# Altium schematic sheet Power1.SchDoc (part 1 of 2)
size A; SheetNumber: 1; SheetTotal: 6
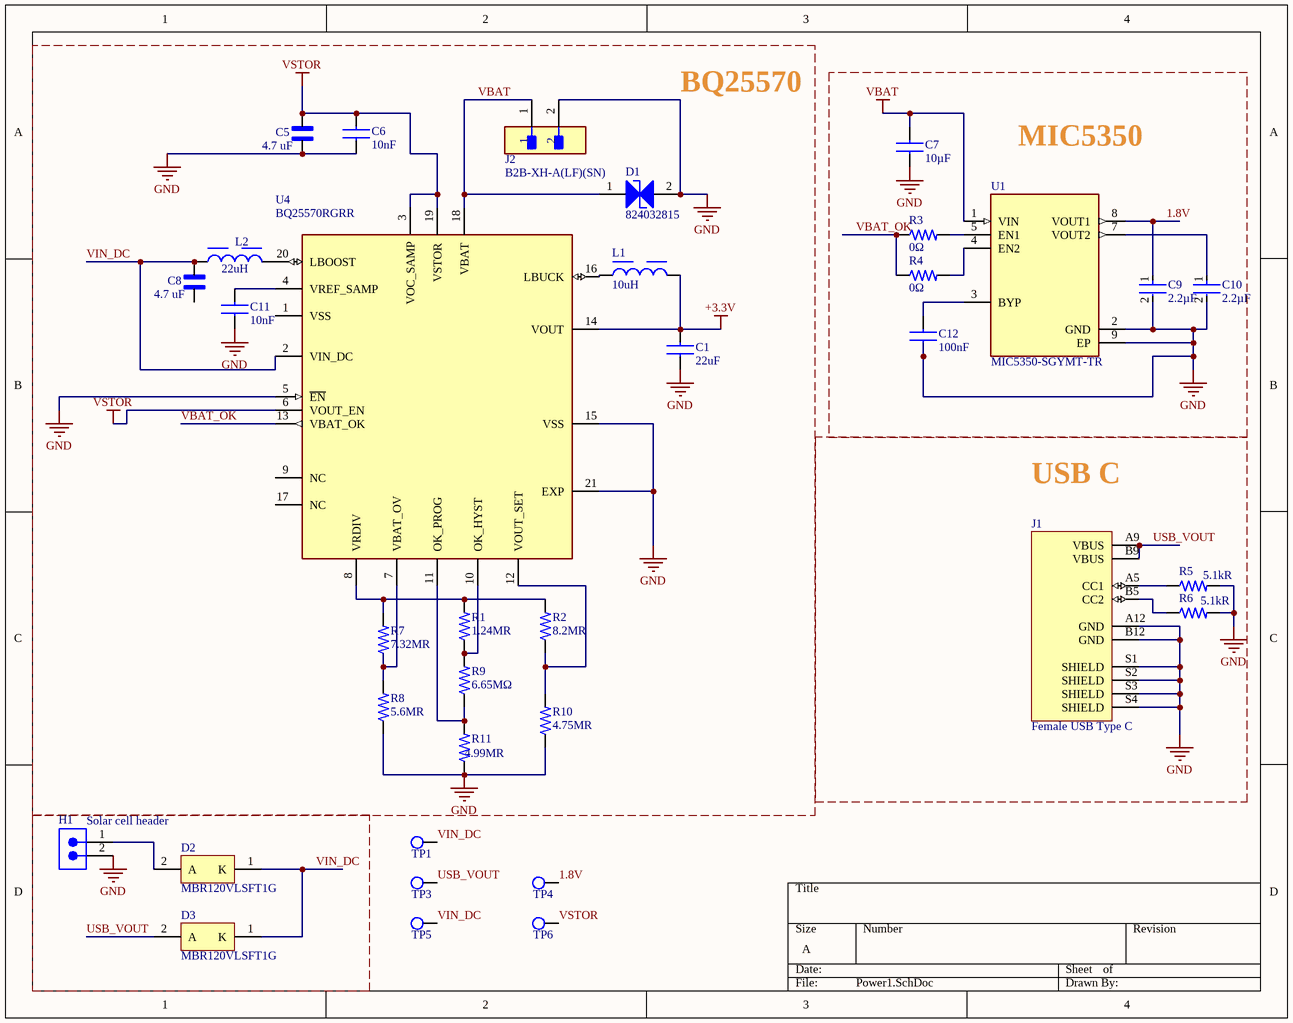
[diagram p0: Power1.SchDoc]

## Parts
C1  22uF  [CAP_0603_1MM]
C5  4.7 uF  [CAPC1608X90N]
C6  value 10nF  [CAP_0603_1MM]  (hidden comment: CAP 10nF 0603)
C7  value 10µF  [CAP_0603_1MM]  (hidden comment: CAP 10uF 0603)
C8  4.7 uF  [CAPC1608X90N]
C9  value 2.2µF  [CAP_0603_1MM]  (hidden comment: CAP 2.2uF 0603)
C10  value 2.2µF  [CAP_0603_1MM]  (hidden comment: CAP 2.2uF 0603)
C11  value 10nF  [CAP_0603_1MM]  (hidden comment: CAP 10nF 0603)
C12  value 100nF  [CAP_0603_1MM]  (hidden comment: CAP 0.1uF 0603)
D1  824032815  [WE-TVS_DFN1610-2L]
D2  MBR120VLSFT1G  [ONSC-SOD-123FL-2-498-01_V]
D3  MBR120VLSFT1G  [ONSC-SOD-123FL-2-498-01_V]
H1  Solar cell header  [2-PIN_MALE_HEADER_01-IN]
J1  Female USB Type C  [GCT_USB4125-GF-A_REVA2]
J2  B2B-XH-A(LF)(SN)  [FP-B2B-XH-A_LF_SN-MFG]
L1  10uH  [WE-TPC_2813]
L2  22uH  [WE-TPC_3816]
R1  value 1.24MR  [RES_0603_1608X06]  (hidden comment: RES 1.24M 0603)
R2  value 8.2MR  [RES_0603_1608X06]  (hidden comment: RES 8.2M 0603)
R3  value 0Ω  [RES_0603_1608X06]  (hidden comment: RES 0R 0603)
R4  value 0Ω  [RES_0603_1608X06]  (hidden comment: RES 0R 0603)
R5  value 5.1kR  [RES_0603_1608X06]  (hidden comment: RES 5.1K 0603)
R6  value 5.1kR  [RES_0603_1608X06]  (hidden comment: RES 5.1K 0603)
R7  value 7.32MR  [RES_0603_1608X06]  (hidden comment: RES 7.32M 0603)
R8  value 5.6MR  [RES_0603_1608X06]  (hidden comment: RES 5.62M 0603)
R9  value 6.65MΩ  [RES_0603_1608X06]  (hidden comment: RES 6.65M 0603)
R10  value 4.75MR  [RES_0603_1608X06]  (hidden comment: RES 4.75M 0603)
R11  value 4.99MR  [RES_0603_1608X06]  (hidden comment: RES 4.99M 0603)
TP1  Test Point  [Test Point]  (value not drawn)  (net tie, no BOM)
TP3  Test Point  [Test Point]  (value not drawn)  (net tie, no BOM)
TP4  Test Point  [Test Point]  (value not drawn)  (net tie, no BOM)
TP5  Test Point  [Test Point]  (value not drawn)  (net tie, no BOM)
TP6  Test Point  [Test Point]  (value not drawn)  (net tie, no BOM)
U1  MIC5350-SGYMT-TR  [SON50P200X200X60-9N]
U4  BQ25570RGRR  [QFN50P350X350X100-21N]

## Blocks framed on the sheet
BQ25570: C1 C5 C6 C8 C11 D1 J2 L1 L2 R1 R2 R7-R11 U4
MIC5350: C7 C9 C10 C12 R3 R4 U1
USB C: J1 R5 R6

## Nets
+3.3V: C1.2 L1.2 U4.14(VOUT)
GND: C1.1 C5.1 C6.2 C7.2 C9.2 C10.2 C11.2 C12.2 D1.2(GND) H1.2 J1.A12(GND) J1.B12(GND) J1.S1(SHIELD) J1.S2(SHIELD) J1.S3(SHIELD) J1.S4(SHIELD) J2.2 R5.2 R6.2 R8.1 R10.1 R11.1 U1.2(GND) U1.9(EP) U4.5(~{EN}) U4.15(VSS) U4.21(EXP)
VBAT: C7.1 D1.1(I/O_1) J2.1 U1.1(VIN) U4.18(VBAT)
VSTOR: C5.2 C6.1 TP6.1 U4.3(VOC_SAMP) U4.6(VOUT_EN) U4.19(VSTOR)
1.8V: C9.1 TP4.1 U1.8(VOUT1)
USB_VOUT: D3.2(A) J1.A9(VBUS) TP3.1
VBAT_OK: R3.1 R4.1 U4.13(VBAT_OK)
VIN_DC: C8.2 D2.1(K) D3.1(K) L2.1 TP1.1 TP5.1 U4.2(VIN_DC)
NetC10_1: C10.1 U1.7(VOUT2)
NetC11_1: C11.1 U4.4(VREF_SAMP)
NetC12_1: C12.1 U1.3(BYP)
NetD2_2: D2.2(A) H1.1
NetJ1_A5: J1.A5(CC1) R5.1
NetJ1_B5: J1.B5(CC2) R6.1
NetL1_1: L1.1 U4.16(LBUCK)
NetL2_2: L2.2 U4.20(LBOOST)
NetR1_1: R1.1 R9.2 U4.10(OK_HYST)
NetR1_2: R1.2 R2.2 R7.2 U4.8(VRDIV)
NetR2_1: R2.1 R10.2 U4.12(VOUT_SET)
NetR3_2: R3.2 U1.5(EN1)
NetR4_2: R4.2 U1.4(EN2)
NetR7_1: R7.1 R8.2 U4.7(VBAT_OV)
NetR9_1: R9.1 R11.2 U4.11(OK_PROG)

Not connected (* = marked no-connect by the designer): C8 1; J1 B9(VBUS); U4 1(VSS) 9(NC) 17(NC)